# Altium schematic sheet level_converter.SchDoc
size A; SheetNumber: 1; SheetTotal: 1
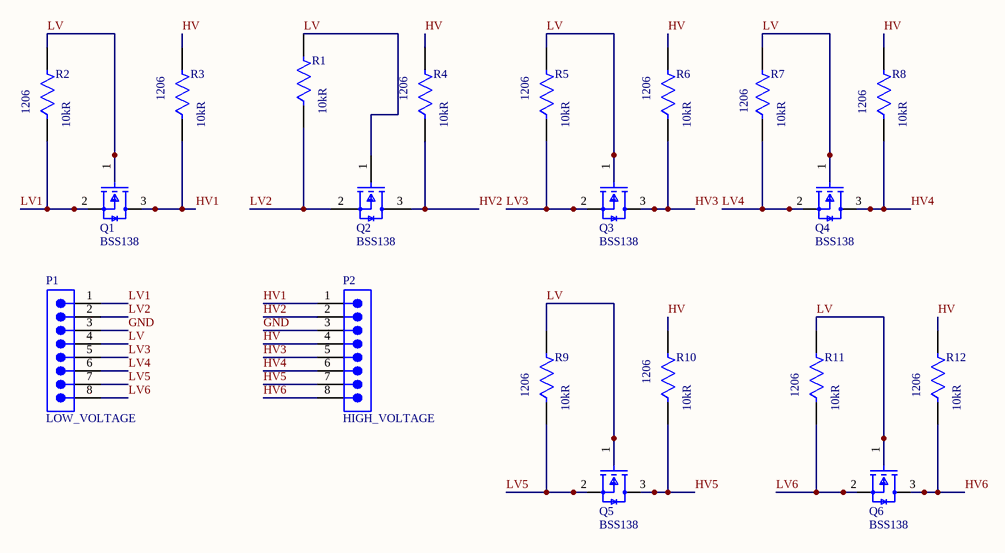
[diagram p0: level_converter.SchDoc]

## Parts
P1  LOW_VOLTAGE  [66200811122]
P2  HIGH_VOLTAGE  [66200811122]
Q1  BSS138  [FP-318-08-IPC_B]
Q2  BSS138  [FP-318-08-IPC_B]
Q3  BSS138  [FP-318-08-IPC_B]
Q4  BSS138  [FP-318-08-IPC_B]
Q5  BSS138  [FP-318-08-IPC_B]
Q6  BSS138  [FP-318-08-IPC_B]
R1  Resistance: 10kR  [FP-CRCW1206-e3-IPC_C]  (hidden comment: CRCW120610K0FKEA)
R2  Resistance: 10kR  Case/Package: 1206  [FP-CRCW1206-e3-IPC_C]  (hidden comment: CRCW120610K0FKEA)
R3  Resistance: 10kR  Case Code (Imperial): 1206  [FP-CRCW1206-e3-IPC_C]  (hidden comment: CRCW120610K0FKEA)
R4  Resistance: 10kR  Case/Package: 1206  [FP-CRCW1206-e3-IPC_C]  (hidden comment: CRCW120610K0FKEA)
R5  Resistance: 10kR  Case/Package: 1206  [FP-CRCW1206-e3-IPC_C]  (hidden comment: CRCW120610K0FKEA)
R6  Resistance: 10kR  Case/Package: 1206  [FP-CRCW1206-e3-IPC_C]  (hidden comment: CRCW120610K0FKEA)
R7  Resistance: 10kR  Case/Package: 1206  [FP-CRCW1206-e3-IPC_C]  (hidden comment: CRCW120610K0FKEA)
R8  Resistance: 10kR  Case/Package: 1206  [FP-CRCW1206-e3-IPC_C]  (hidden comment: CRCW120610K0FKEA)
R9  Resistance: 10kR  Case/Package: 1206  [FP-CRCW1206-e3-IPC_C]  (hidden comment: CRCW120610K0FKEA)
R10  Resistance: 10kR  Case/Package: 1206  [FP-CRCW1206-e3-IPC_C]  (hidden comment: CRCW120610K0FKEA)
R11  Resistance: 10kR  Case/Package: 1206  [FP-CRCW1206-e3-IPC_C]  (hidden comment: CRCW120610K0FKEA)
R12  Resistance: 10kR  Case/Package: 1206  [FP-CRCW1206-e3-IPC_C]  (hidden comment: CRCW120610K0FKEA)

## Nets
GND: P1.3 P2.3
HV: P2.4 R3.2 R4.2 R6.2 R8.2 R10.2 R12.2
HV1: P2.1 Q1.3(D) R3.1
HV2: P2.2 Q2.3(D) R4.1
HV3: P2.5 Q3.3(D) R6.1
HV4: P2.6 Q4.3(D) R8.1
HV5: P2.7 Q5.3(D) R10.1
HV6: P2.8 Q6.3(D) R12.1
LV: P1.4 Q1.1(G) Q2.1(G) Q3.1(G) Q4.1(G) Q5.1(G) Q6.1(G) R1.2 R2.2 R5.2 R7.2 R9.2 R11.2
LV1: P1.1 Q1.2(S) R2.1
LV2: P1.2 Q2.2(S) R1.1
LV3: P1.5 Q3.2(S) R5.1
LV4: P1.6 Q4.2(S) R7.1
LV5: P1.7 Q5.2(S) R9.1
LV6: P1.8 Q6.2(S) R11.1

## Library data of the parts
P1 P2 = CMP-1502-00446-2: NexarPartId: 23024701; Pitch: 3mm; Number of Contacts: 8; Insulation Resistance: 1GΩ; Connector Type: Male Pin, Socket; Contact Resistance: 10mΩ; Gender: Male; Current Rating: 5A; Operating Supply Voltage: 250V; Height: 11mm; Max Operating Temperature: 105°C; Mount: Through Hole; Orientation: Vertical; Fastening Type: Ramp; Number of Positions: 8; Lead Pitch: 3mm; Number of Rows: 1; RoHS: Compliant; Termination: Kinked Pin; Width: 27.65mm; Contact Material: Copper; REACH SVHC: Unknown; Contact Plating: Tin; Length: 27.65mm; Color: Black; Min Operating Temperature: -40°C; Number of Pins: 8
Q1-Q6 = CMP-07173-000101-1: MOSFET N-CH 50V 220MA SOT-23; Turn-Off Delay Time: 20ns; Element Configuration: Single; Rds On Max: 3.5R; Gate to Source Voltage (Vgs): 20V; Threshold Voltage: 1.3V; Number of Elements: 1; Power Dissipation: 360mW; Rise Time: 9ns; Turn-On Delay Time: 2.5ns; Input Capacitance: 27pF; On-State Resistance: 6R; Lead Free: Lead Free; Length: 2.92mm; Width: 1.3mm; Drain to Source Breakdown Voltage: 50V; Min Operating Temperature: -55°C; REACH SVHC: No SVHC; Packaging: Tape and Reel; Radiation Hardening: No; Height: 0.93mm; Drain to Source Voltage (Vdss): 50V; Current Rating: 220mA; Voltage Rating (DC): 50V; Weight: 0.03g; Continuous Drain Current (ID): 220mA; Number of Pins: 3; Nominal Vgs: 1.3V; Max Power Dissipation: 360mW; Fall Time: 9ns; Drain to Source Resistance: 3.5R; Contact Plating: Tin; Case/Package: SOT-23; Package Quantity: 1; Dual Supply Voltage: 50V; Mount: Surface Mount; Termination: SMD/SMT; Max Operating Temperature: 150°C
R1-R12 = CMP-2003-04807-2: RES Thick Film, 10kΩ, 1%, 0.25W, 100ppm/°C, 1206; Working Voltage: 200V; Max Power Dissipation: 250mW; Tolerance: 1%; Width: 0.063inch; Height: 0.55mm; Number of Pins: 2; Voltage Rating: 200V; Temperature Coefficient: 100ppm/°C; Military Standard: Not; Features: Automotive AEC-Q200; Depth: 1.6mm; Radiation Hardening: No; Termination: SMD/SMT; Weight: 0.000353oz; Length: 3.2mm; Package Quantity: 10; Voltage Rating (DC): 200V; Min Operating Temperature: -55°C; Number of Terminations: 2; Composition: Thick Film; Contact Plating: Tin; Power Rating: 250mW; Packaging: Tape and Reel; Max Operating Temperature: 155°C; Lead Free: Lead Free; Case Code (Metric): 3216
  R1: Case Code (Imperial): 1206; Case/Package: 1206
  R2 R4-R12: Case Code (Imperial): 1206
  R3: Case/Package: 1206